# EasyEDA schematic 7.3PCB Sheet.json
TITLE: 7.3 PCB; REV: 1.0; Date: 2020-05-24; Sheet: 1/1; Drawn By: chenyinhao; Company: Deakin
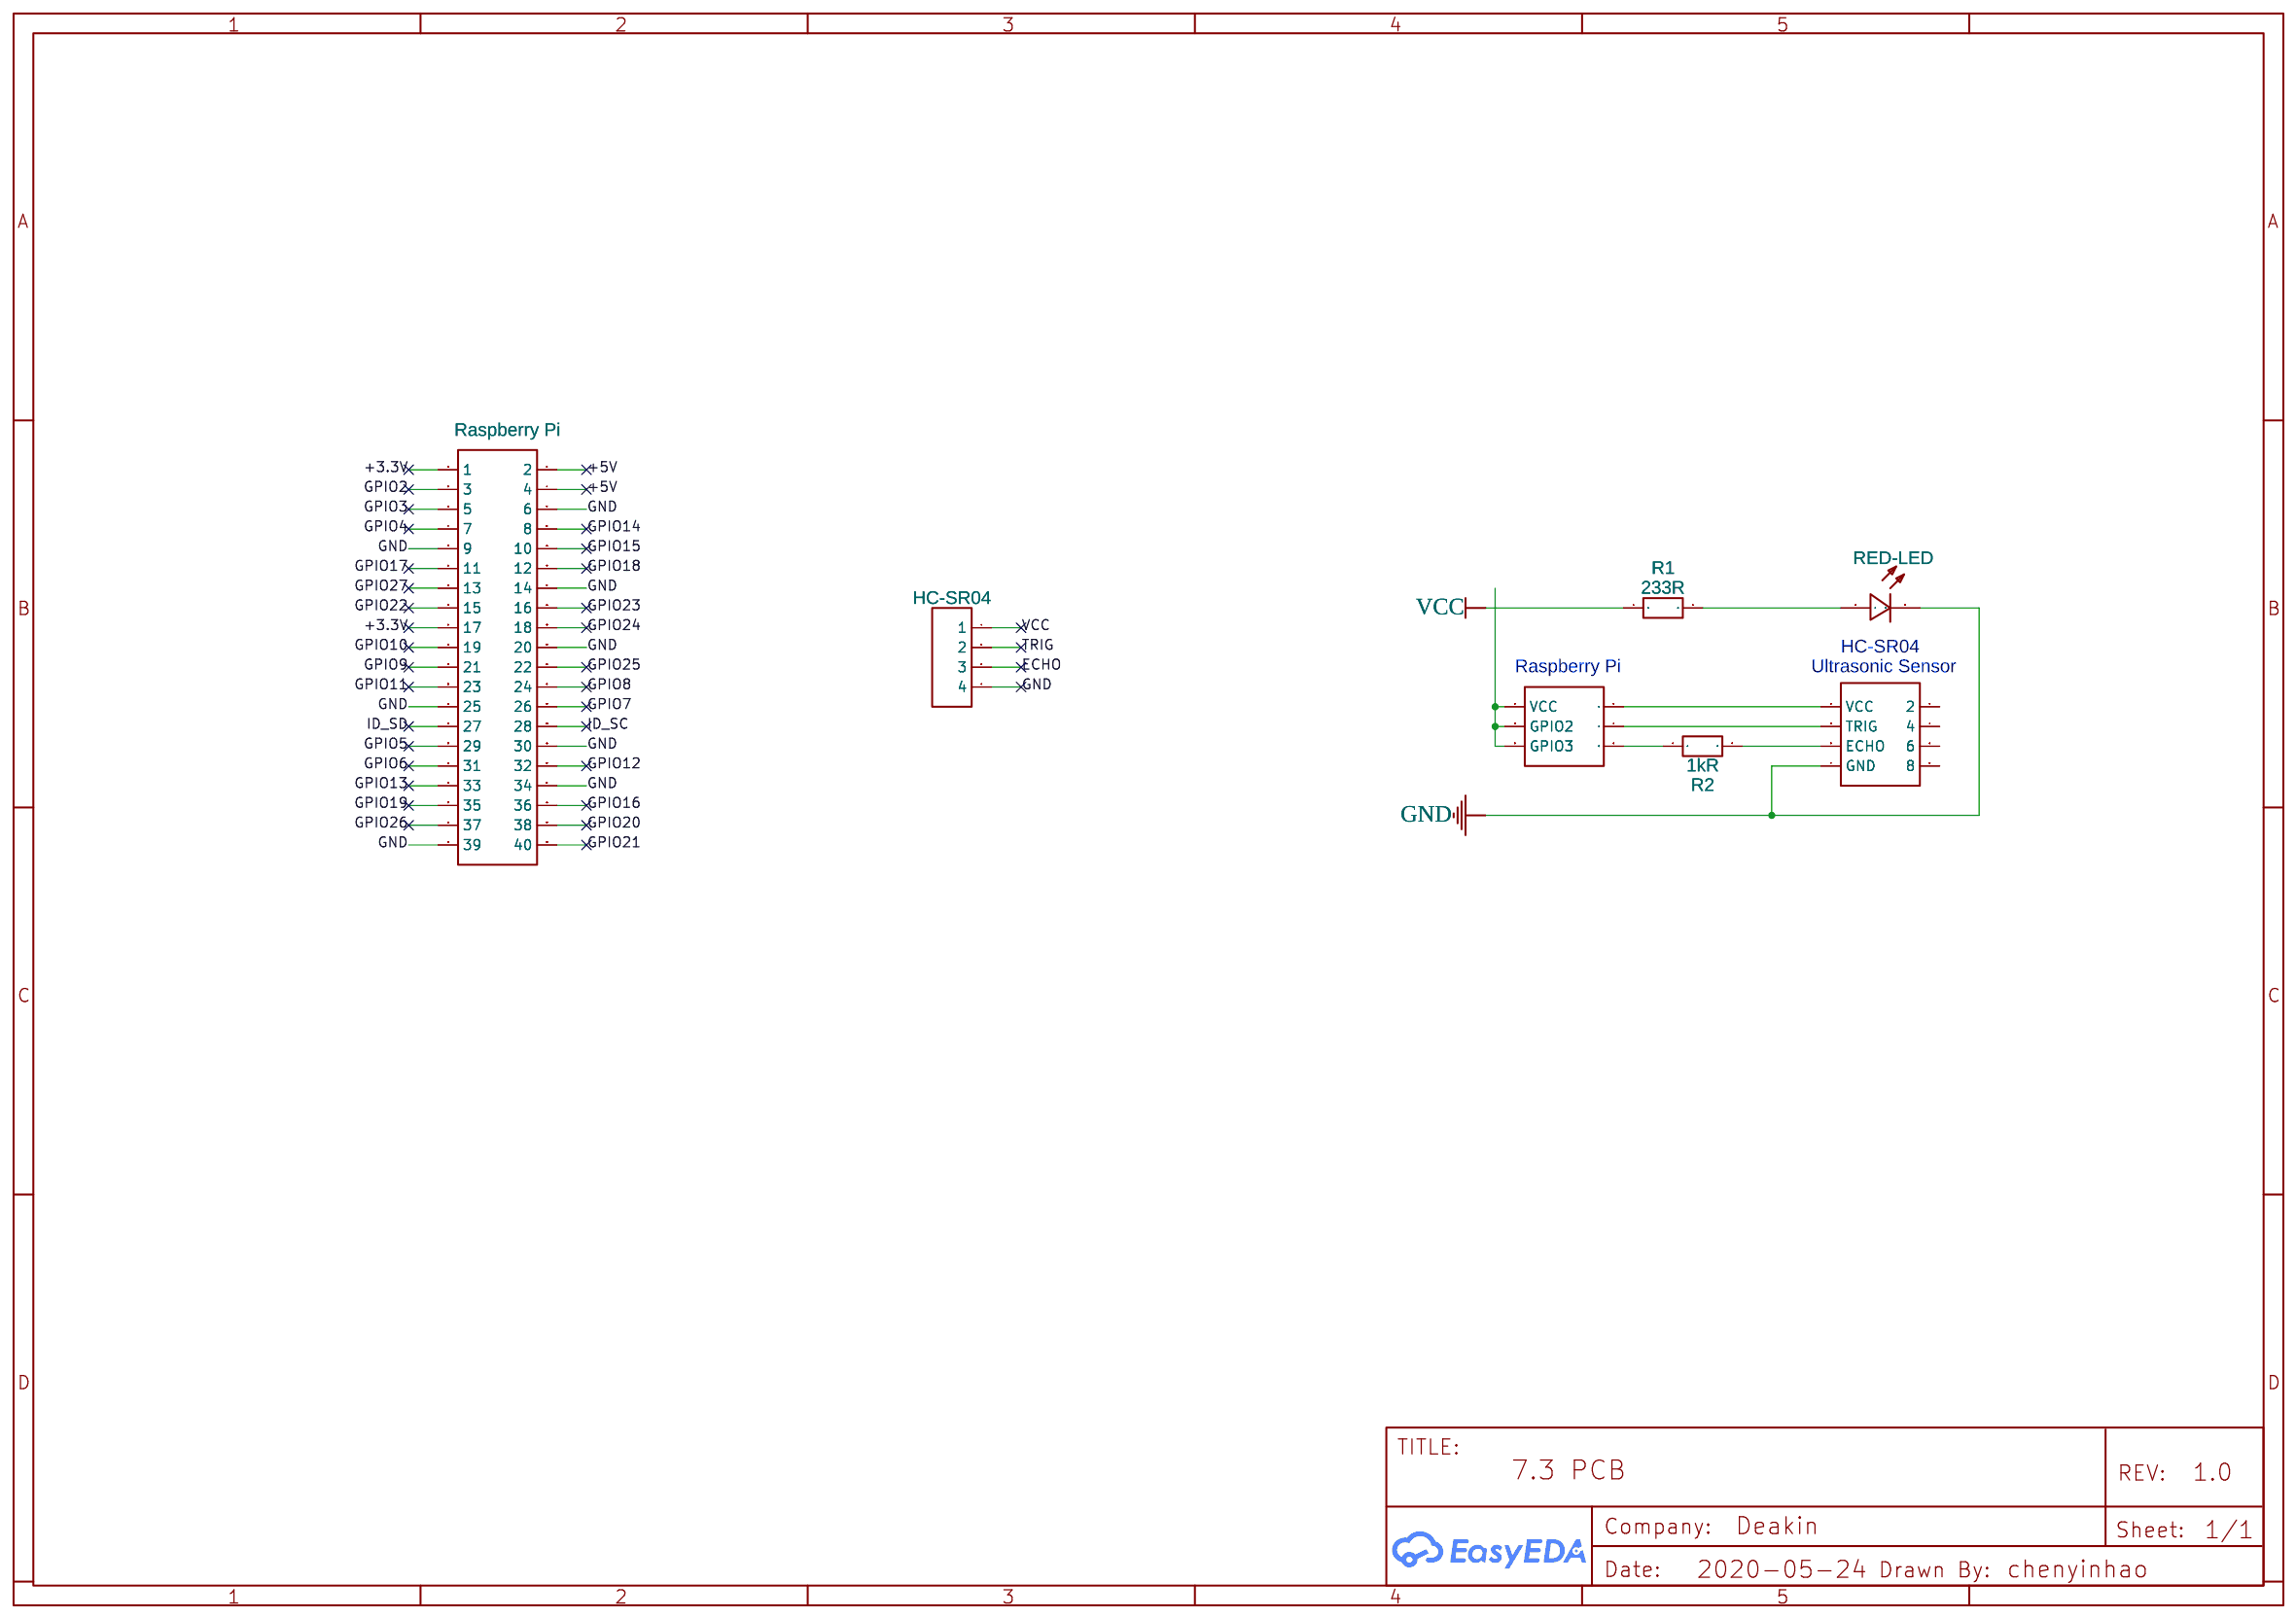
[diagram p0: schematic sheet]

## Parts
H1  HC-SR04  [HDR-F-2.54_1X4]
J1  HDR-M-2.54_2x4  [HDR-M-2.54_2X4]
P1  Raspberry Pi  [HDR-F-2.54_2X20]
P2  HDR-IDC-2.54-2X3P  [IDC-TH_6P-P2.54_C11214]
R1  233R  [R0201]
R2  1kR  [R0201]
RED-LED  TJ-L3FYTGHRMBCLFLC4R-A5  [LED-TH_BD3.9-P2.54-FD]

## Library data of the parts
H1 = HDR-F-2.54_1x4: Supplier Part: C225501; Supplier: LCSC; Contributor: LCEDA_Lib
J1 = HDR-M-2.54_2x4: Supplier Part: C58363; Supplier: LCSC; Contributor: LCEDA_Lib
P1 = HDR-F-2.54_2x20: Supplier Part: C50982; Supplier: LCSC; Contributor: LCEDA_Lib
P2 = HDR-IDC-2.54-2X3P: Supplier: LCSC; Manufacturer: BOOMELE; Manufacturer Part: 2X3 2.54mm IDC Box; image: //image.lceda.cn/szlcsc/C11214.jpg; Supplier Part: C11214
R1 R2 = R_0201_EU: Contributor: LCEDA_Lib
RED-LED = TJ-L3FYTGHRMBCLFLC4R-A5: Supplier: LCSC; Supplier Part: C330773; Manufacturer: TOGIALED; Contributor: LCSC

## Nets
+3.3V: P1.1 P1.17
+5V: P1.2 P1.4
GND: H1.1(4) J1.7(GND) P1.6 P1.9 P1.14 P1.20 P1.25 P1.30 P1.34 P1.39 RED-LED.2
VCC: H1.4(1) R1.1
ECHO: H1.2(3)
GPIO2: P1.3
GPIO3: P1.5
GPIO4: P1.7
GPIO5: P1.29
GPIO6: P1.31
GPIO7: P1.26
GPIO8: P1.24
GPIO9: P1.21
GPIO10: P1.19
GPIO11: P1.23
GPIO12: P1.32
GPIO13: P1.33
GPIO14: P1.8
GPIO15: P1.10
GPIO16: P1.36
GPIO17: P1.11
GPIO18: P1.12
GPIO19: P1.35
GPIO20: P1.38
GPIO21: P1.40
GPIO22: P1.15
GPIO23: P1.16
GPIO24: P1.18
GPIO25: P1.22
GPIO26: P1.37
GPIO27: P1.13
ID_SC: P1.28
ID_SD: P1.27
TRIG: H1.3(2)
Net-(J1-1): J1.1(VCC) P2.2
Net-(J1-3): J1.3(TRIG) P2.4
Net-(J1-5): J1.5(ECHO) R2.2
Net-(P2-1): P2.1(VCC) P2.3(GPIO2) P2.5(GPIO3)
Net-(P2-6): P2.6 R2.1
Net-(R1-2): R1.2 RED-LED.1

Not connected (* = marked no-connect by the designer): J1 2 4 6 8

## Notes on the sheet
- HC-SR04
- Raspberry Pi
- Ultrasonic Sensor
